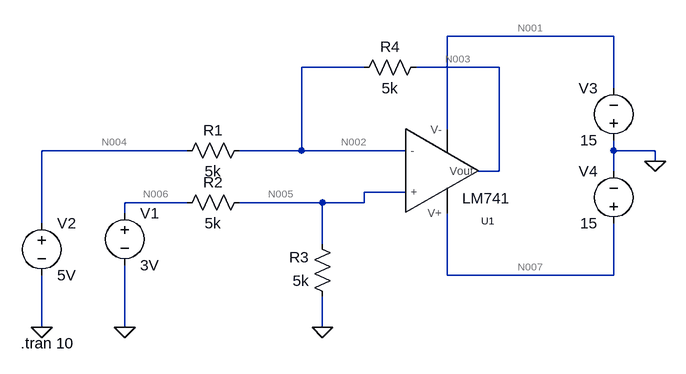
[diagram p0: schematic scalling subtractor.asc]
scalling subtractor.asc, the LTspice schematic file:
Version 4.1
SHEET 1 880 680
WIRE 560 -64 304 -64
WIRE 176 -16 80 -16
WIRE 384 -16 256 -16
WIRE 560 16 560 -64
WIRE 304 80 304 -64
WIRE -96 112 -320 112
WIRE 80 112 80 -16
WIRE 80 112 -16 112
WIRE 240 112 80 112
WIRE 560 112 560 96
WIRE 624 112 560 112
WIRE 624 128 624 112
WIRE 384 144 384 -16
WIRE 384 144 352 144
WIRE 560 144 560 112
WIRE 240 176 176 176
WIRE -96 192 -192 192
WIRE 112 192 -16 192
WIRE 176 192 176 176
WIRE 176 192 112 192
WIRE -192 208 -192 192
WIRE -320 224 -320 112
WIRE 112 256 112 192
WIRE 304 304 304 208
WIRE 560 304 560 224
WIRE 560 304 304 304
WIRE -320 384 -320 304
WIRE -192 384 -192 288
WIRE 112 384 112 336
FLAG 624 128 0
FLAG 112 384 0
FLAG -192 384 0
FLAG -320 384 0
SYMBOL LM\ 741\\LM741 288 128 M180
WINDOW 3 76 -73 Top 2
SYMATTR InstName U1
SYMBOL res 0 96 R90
WINDOW 0 0 56 VBottom 2
WINDOW 3 32 56 VTop 2
SYMATTR InstName R1
SYMATTR Value 5k
SYMBOL res 0 176 R90
WINDOW 0 0 56 VBottom 2
WINDOW 3 32 56 VTop 2
SYMATTR InstName R2
SYMATTR Value 5k
SYMBOL res 128 352 R180
WINDOW 0 36 76 Left 2
WINDOW 3 36 40 Left 2
SYMATTR InstName R3
SYMATTR Value 5k
SYMBOL voltage -192 192 R0
WINDOW 123 0 0 Left 0
WINDOW 39 0 0 Left 0
SYMATTR InstName V1
SYMATTR Value 3V
SYMBOL voltage -320 208 R0
WINDOW 123 0 0 Left 0
WINDOW 39 0 0 Left 0
SYMATTR InstName V2
SYMATTR Value 5V
SYMBOL res 272 -32 R90
WINDOW 0 0 56 VBottom 2
WINDOW 3 32 56 VTop 2
SYMATTR InstName R4
SYMATTR Value 5k
SYMBOL voltage 560 112 R180
WINDOW 0 24 96 Left 2
WINDOW 3 24 16 Left 2
WINDOW 123 0 0 Left 0
WINDOW 39 0 0 Left 0
SYMATTR InstName V3
SYMATTR Value 15
SYMBOL voltage 560 240 R180
WINDOW 0 24 96 Left 2
WINDOW 3 24 16 Left 2
WINDOW 123 0 0 Left 0
WINDOW 39 0 0 Left 0
SYMATTR InstName V4
SYMATTR Value 15
TEXT -352 408 Left 2 !.tran 10

The netlist it stands for:
* scalling subtractor.asc
X§U1 N005 N002 N007 N001 N003 LM741  ; pins + - V+ V- Vout
R1 N002 N004 5k
R2 N005 N006 5k
R3 0 N005 5k
V1 N006 0 3V
V2 N004 0 5V
R4 N003 N002 5k
V3 0 N001 15
V4 N007 0 15
.tran 10
.lib C:\Users\Subodha\Desktop\Desk\2nd Semester\Electronics\LT Spices\Unity gain amplifier\LM 741\lm741.lib
.backanno
.end

* Results of the author's LTspice run, read from the files saved beside the schematic
* Operating Point, zero values left out:
*   V(n002) = 1.501 V
*   V(n001) = -15 V
*   V(n003) = -1.998 V
*   V(n006) = 3 V
*   V(n005) = 1.5 V
*   V(n007) = 15 V
*   V(n004) = 5 V
*   I(V1) = -300 µA
*   I(R4) = -699.7 µA
*   I(R1) = -699.8 µA
*   I(V3) = -2.33 mA
*   I(R2) = -300 µA
*   I(R3) = -300 µA
*   I(V2) = -699.8 µA
*   I(V4) = -1.63 mA
*   Ix(u1:1) = 57.73 nA
*   Ix(u1:2) = 102 nA
*   Ix(u1:99) = 1.63 mA
*   Ix(u1:50) = -2.33 mA
*   Ix(u1:28) = 699.7 µA